# EAGLE design Prototipo_2X (EAGLE 6.5.0)
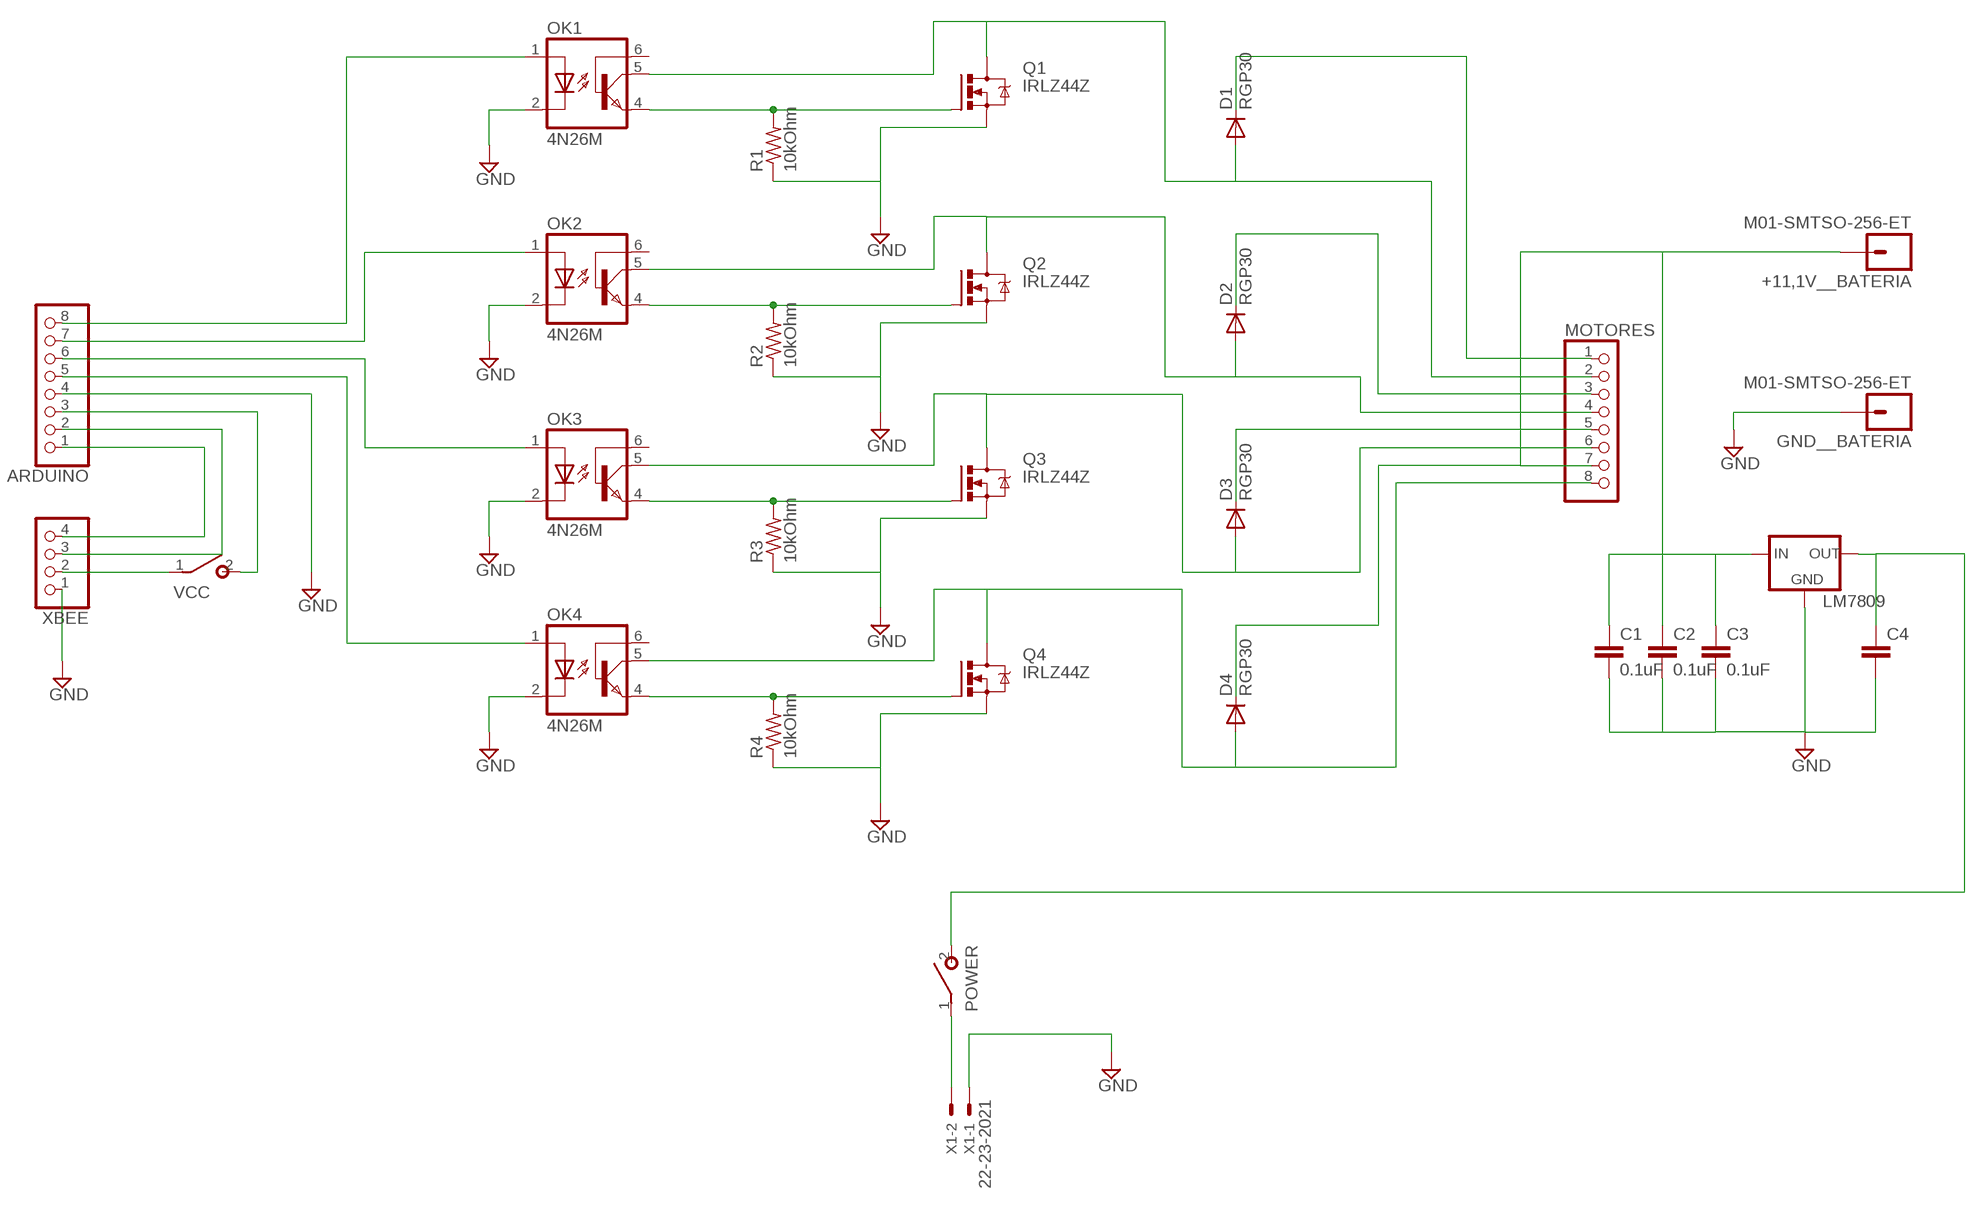
[diagram p0: schematic, sheet 1]

## Parts
+11,1V__BATERIA  M01-SMTSO-256-ET  [SMTSO-256-ET]
ARDUINO  PINHD-1X8/90  [1X08/90]
C1  0.1uF  0.1UF-50V-20%(PTH)KIT-EZ  [CAP-PTH-SMALL-KIT]
C2  0.1uF  0.1UF-50V-20%(PTH)KIT-EZ  [CAP-PTH-SMALL-KIT]
C3  0.1uF  0.1UF-50V-20%(PTH)KIT-EZ  [CAP-PTH-SMALL-KIT]
C4  0.1UF-50V-20%(PTH)KIT-EZ  [CAP-PTH-SMALL-KIT]
D1  RGP30  [DO201-15]
D2  RGP30  [DO201-15]
D3  RGP30  [DO201-15]
D4  RGP30  [DO201-15]
GND__BATERIA  M01-SMTSO-256-ET  [SMTSO-256-ET]
LM7809  78XXL  [78XXL]
MOTORES  PINHD-1X8/90  [1X08/90]
OK1  4N26M  [DIL06]
OK2  4N26M  [DIL06]
OK3  4N26M  [DIL06]
OK4  4N26M  [DIL06]
POWER  SPST  [SPST]
Q1  IRLZ44Z  [TO220BH]
Q2  IRLZ44Z  [TO220BH]
Q3  IRLZ44Z  [TO220BH]
Q4  IRLZ44Z  [TO220BH]
R1  10kOhm  R-US_0207/7  [0207/7]
R2  10kOhm  R-US_0207/7  [0207/7]
R3  10kOhm  R-US_0207/7  [0207/7]
R4  10kOhm  R-US_0207/7  [0207/7]
VCC  SPST  [SPST]
X1  22-23-2021  [22-23-2021]
XBEE  PINHD-1X4  [1X04]

## Nets
GND [power]: ARDUINO.4 C1.2 C2.2 C3.2 C4.2 GND__BATERIA.P$1 LM7809.GND OK1.2(C) OK2.2(C) OK3.2(C) OK4.2(C) Q1.S Q2.S Q3.S Q4.S R1.1 R2.1 R3.1 R4.1 X1.1 XBEE.1
N$1: ARDUINO.8 OK1.1(A)
N$2: ARDUINO.7 OK2.1(A)
N$3: ARDUINO.6 OK3.1(A)
N$4: ARDUINO.5 OK4.1(A)
N$5: ARDUINO.1 XBEE.4
N$6: C4.1 LM7809.OUT POWER.2(S)
N$7: VCC.1(P) XBEE.2
N$8: OK1.4(EMI) Q1.G R1.2
N$9: OK2.4(EMI) Q2.G R2.2
N$10: OK3.4(EMI) Q3.G R3.2
N$11: OK4.4(EMI) Q4.G R4.2
N$12: +11,1V__BATERIA.P$1 C1.1 C2.1 C3.1 D1.C D2.C D3.C D4.C LM7809.IN MOTORES.1 MOTORES.3 MOTORES.5 MOTORES.7
N$13: ARDUINO.2 XBEE.3
N$14: D2.A MOTORES.4 OK2.5(COL) Q2.D
N$15: D3.A MOTORES.6 OK3.5(COL) Q3.D
N$16: D4.A MOTORES.8 OK4.5(COL) Q4.D
N$17: D1.A MOTORES.2 OK1.5(COL) Q1.D
N$18: POWER.1(P) X1.2
N$20: ARDUINO.3 VCC.2(S)
Unconnected: OK1.6(BAS) OK2.6(BAS) OK3.6(BAS) OK4.6(BAS)

## Library data of the parts
+11,1V__BATERIA GND__BATERIA = SparkFun-Connectors:M01: Header 1 Standard 1-pin 0.1" header. Use with straight break away headers (SKU : PRT-00116), right angle break away headers (PRT-00553), swiss pins (PRT-00743), machine pins (PRT-00117), and female headers (PRT-00115).
ARDUINO MOTORES = pinhead:PINHD-1X8: PIN HEADER
C1-C4 = SparkFun-Capacitors:0.1UF-50V-20%(PTH): CAP-08370; PROD_ID: CAP-08370
D1-D4 = diode:RGP30: DIODE fast-recovery rectifier
LM7809 = v-reg:78XXL: VOLTAGE REGULATOR
OK1-OK4 = optocoupler:4N*?M: General Purpose 6-Pin Phototransistor Optocouplers Source: http://www.fairchildsemi.com/ds/4N/4N35-M.pdf; MPN: 4N26-M; OC_FARNELL: 1021350; OC_NEWARK: 98K9089
POWER VCC = gm-switches:SPST
Q1-Q4 = transistor-power:IRLZ44Z: N-Channel HEXFET® Power MOSFET Logic Level AUTOMOTIVE MOSFET Source: http://www.irf.com/product-info/datasheets/data/irlz44zpbf.pdf
R1-R4 = rcl:R-US_: RESISTOR, American symbol
X1 = con-molex:22-23-2021: .100" (2.54mm) Center Header - 2 Pin; MF: MOLEX; MPN: 22-23-2021; OC_FARNELL: 1462926; OC_NEWARK: 25C3832
XBEE = pinhead:PINHD-1X4: PIN HEADER

## Net classes
0 default: clearance 0.205 mm
1 power: width 0.655 mm, drill 10.22 mm, clearance 0.205 mm to class 0, clearance 0.205 mm

## Board
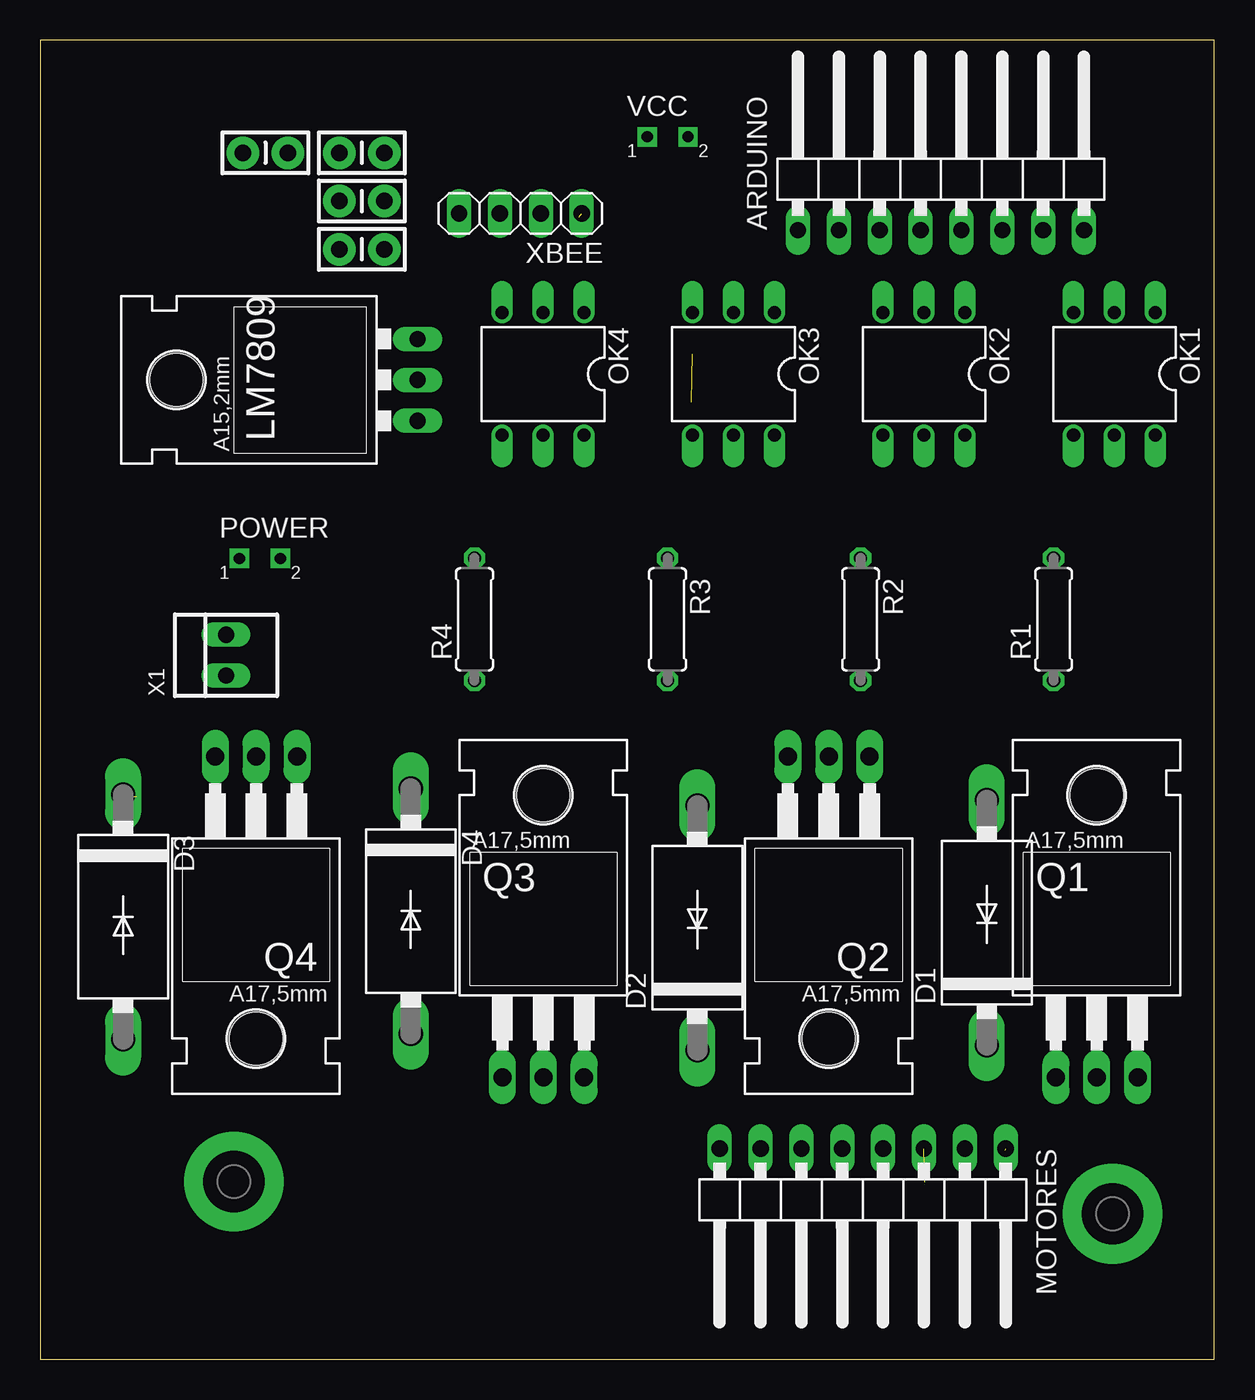
[diagram p1: board, top side]
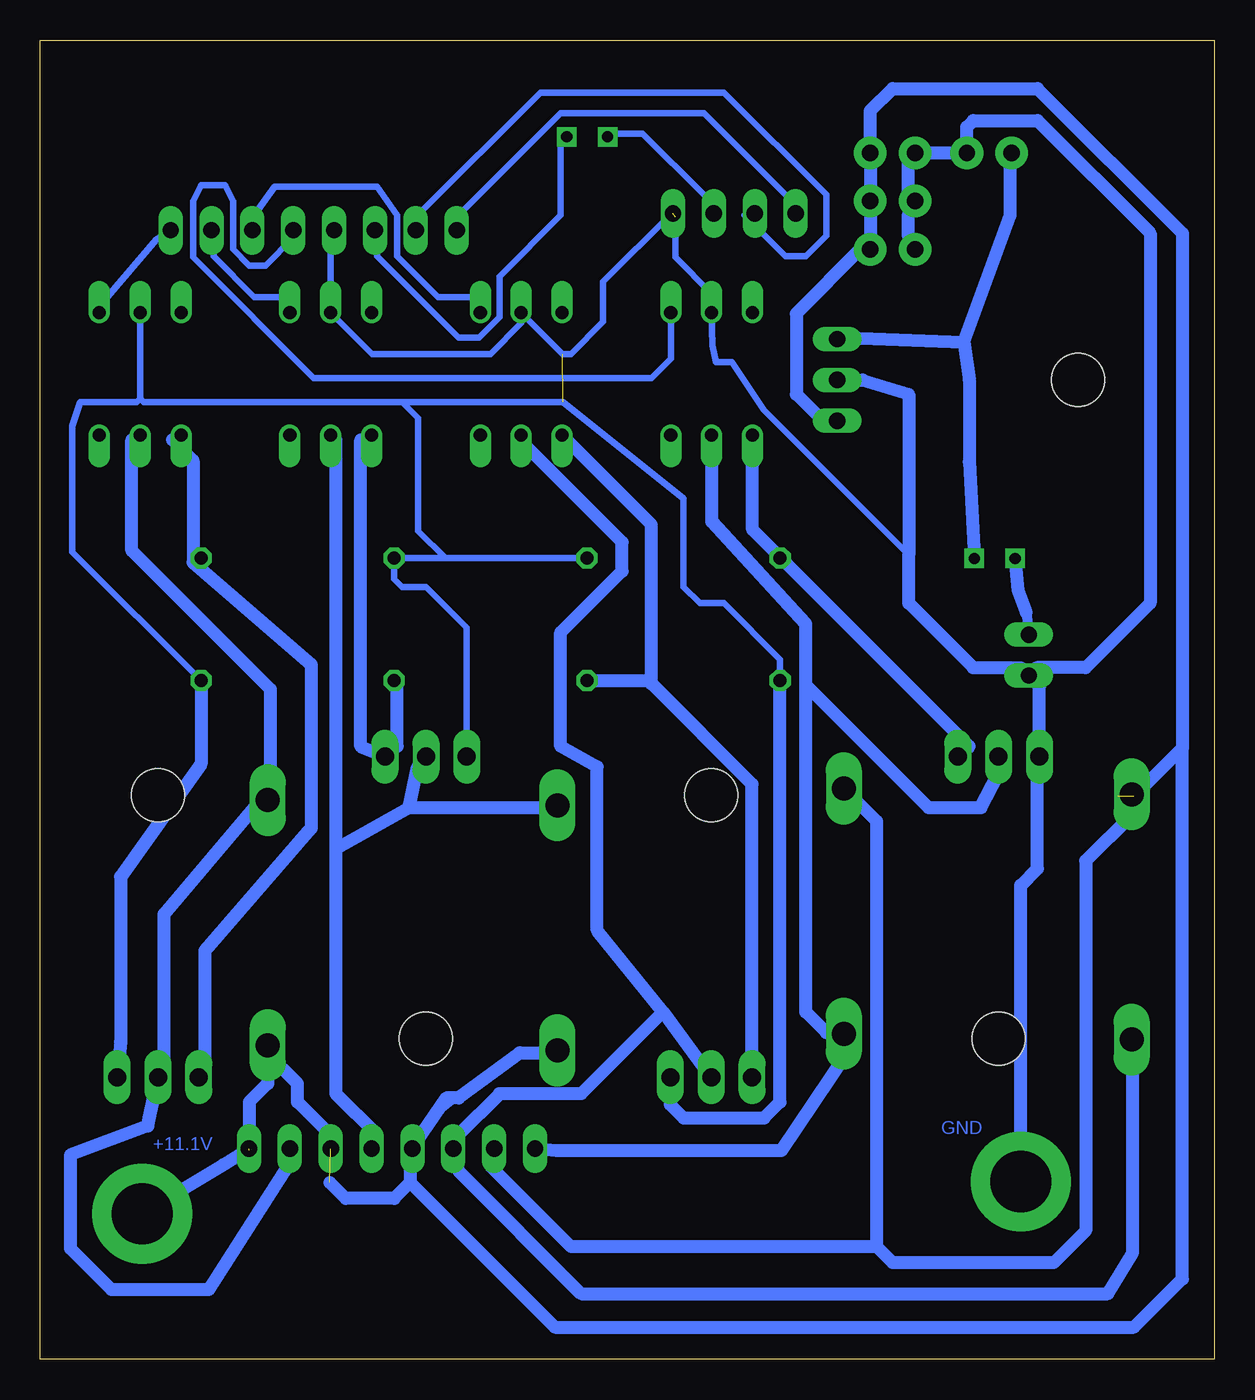
[diagram p2: board, bottom side, seen from below]

Size 73 x 82 mm. Coordinates in mm from the lower left corner, seen from the top.
Outline: 0,0 73,0 73,82 0,82 0,0
Copper layers (1*16): Top 0.035mm / dielectric 1.5mm / Bottom 0.035mm
Design rules: minimum track width 10mil, minimum drill 24mil, track to track 8mil, track to pad 8mil, pad to pad 8mil, via to via 8mil, smd to smd 8mil, copper to edge 40mil, drill to drill 8mil, minimum pad ring 10mil, minimum via ring 8mil, stop-mask expansion 4mil, vias tented up to drill 0mil, thermal gap 10mil

### Footprints (pad centres in the part's own frame; a part is rotated, then mirrored left to right if it is on the bottom)
SMTSO-256-ET = drill 3.81 pad 6.198: P$1 0,0
1X08/90 = drill 1.016 long: 1 -8.89,-3.81; 2 -6.35,-3.81; 3 -3.81,-3.81; 4 -1.27,-3.81; 5 1.27,-3.81; 6 3.81,-3.81; 7 6.35,-3.81; 8 8.89,-3.81
CAP-PTH-SMALL-KIT = drill 1.016 pad 2.032: 1 -1.397,0; 2 1.397,0
DO201-15 = drill 1.499 long: A 7.62,0; C -7.62,0
78XXL = drill 1.016 long: GND 0,-3.81; IN -2.54,-3.81; OUT 2.54,-3.81 | hole 3.302: 0,11.176
DIL06 = drill 0.813 offset: 1 -2.54,-3.81; 2 0,-3.81; 3 2.54,-3.81; 4 2.54,3.81; 5 0,3.81; 6 -2.54,3.81
SPST = drill 0.7 square: 1 -1.27,0; 2 1.27,0
TO220BH = drill 1.118 long: D 0,-6.35; G -2.54,-6.35; S 2.54,-6.35 | hole 3.302: 0,11.176
0207/7 = drill 0.813 octagon: 1 -3.81,0; 2 3.81,0
22-23-2021 = drill 1 long: 1 -1.27,0; 2 1.27,0
1X04 = drill 1.016 long: 1 -3.81,0; 2 -1.27,0; 3 1.27,0; 4 3.81,0

### Placement (x,y rotation side)
+11,1V__BATERIA  66.66,9.04 0 top
ARDUINO  56,74 0 top
C1  20,72 180 top
C2  20,75 180 top
C3  20,69 180 top
C4  14,75 0 top
D1  58.85,27.14 90 top
D2  40.85,26.82 90 top
D3  5.15,27.5 270 top
D4  23.04,27.86 270 top
GND__BATERIA  12.04,11.04 0 top
LM7809  19.65,60.88 90 top
MOTORES  51.13,9.28 180 top
OK1  66.78,61.25 180 top
OK2  54.94,61.25 180 top
OK3  43.1,61.25 180 top
OK4  31.26,61.25 180 top
POWER  13.66,49.78 0 top
Q1  65.68,23.89 0 top
Q2  49.02,31.11 180 top
Q3  31.28,23.89 0 top
Q4  13.42,31.11 180 top
R1  63,46 90 top
R2  51,46 270 top
R3  39,46 270 top
R4  27,46 90 top
VCC  39,76 0 top
X1  11.55,43.77 90 top
XBEE  29.85,71.23 180 top

### Tracks (layer width: path | path; a pad name or v marks a point on that pad's centre or on a via)
GND  (2 unrouted)
  Bottom 0.406: 19,50 28,59 30,62 31,62 31.2,63 OK4.2 31.26,66.26 33.5,68.5 33.5,71 34,71.5 | XBEE.1 33.77,71.23 38,67 38,64.5 40,62.5 40.54,62.5 OK3.2 43.1,64.4 45,62.5 52.38,62.5 OK2.2 54.94,69.98 ARDUINO.4 | OK1.2 66.78,59.72 | 66.78,59.72 67,59.5 70.5,59.5 71,58 71,50.19 R1.1 | 46.5,37.48 46.5,45.5 49,48 50.5,48 51,48.5 R2.1 R3.1 47.81,49.81 49.5,51.5 49.5,58.5 50.5,59.5 | 50.5,59.5 66.56,59.5 66.78,59.72 | R4.1 27,43.5 30.5,47 32,47 33,48 33,53.5 40.5,59.5 50.5,59.5
  Bottom 0.61: 19.05,69.85 C3.2 | 19.05,71.12 C1.2 19.05,72.39 | 19.05,74.93 C2.2
  Bottom 0.813: 19.05,71.12 19.05,69.85 | 19.05,74.93 19.05,72.39 | X1.1 10.88,41.83 Q4.S 11,37.34 11,30.5 12.04,29.46 GND__BATERIA.P$1 | R1.1 63,37 68,30 68,19.76 Q1.S | Q3.S 33.82,15.82 33,15 28,15 27,16 R4.1 | LM7809.GND 21.88,60.88 19,60 19,50 19,47 15,43 12.05,43 X1.1 | 46.5,37.48 Q2.S | C2.2 C4.2 | C4.2 15,75 | C4.2 15.4,76.6 15,77 11,77 4,70 4,47 8,43 11.05,43 X1.1
N$1
  Bottom 0.406: OK1.1 68.85,66.04 65.77,69.62 ARDUINO.8
N$2
  Bottom 0.254: 57.15,66.04 OK2.1
  Bottom 0.406: 57.15,66.04 59.69,66.04 62.23,68.58 62.23,69.85 ARDUINO.7
N$3
  Bottom 0.254: 45.72,66.04 OK3.1
  Bottom 0.406: 45.72,66.04 48.26,66.04 50.8,68.58 50.8,71.12 52.07,72.89 58.42,72.89 59.69,71.12 ARDUINO.6
N$4
  Bottom 0.406: ARDUINO.5 57.27,69.73 59,68 60,68 61,69 61,72 61.5,73 63,73 63.5,72 63.5,68.5 56,61 35,61 33.8,62.2 OK4.1
N$5
  Bottom 0.254: 26.67,72.39 XBEE.4
  Bottom 0.406: 26.67,72.39 31.75,77.47 40.64,77.47 46.99,71.12 ARDUINO.1
N$6
  Bottom 0.254: 12.7,74.93 C4.1
  Bottom 0.61: 22.86,63.5 LM7809.OUT
  Bottom 0.813: 22.86,63.5 15.59,63.23 | 15.59,63.23 15.24,60.88 15.24,55.8 POWER.2 | 12.7,74.93 12.7,71.12 15.59,63.23
N$7
  Bottom 0.254: 38.1,76.2 VCC.1 | 31.75,72.39 XBEE.2
  Bottom 0.406: 38.1,76.2 35.56,76.2 31.75,72.39
N$8
  Bottom 0.254: 63.5,49.53 R1.2
  Bottom 0.813: OK1.4 64.77,57.15 63.5,55.88 63.5,49.53 56.15,43.18 56.15,33.02 62.77,25.4 62.77,18.78 Q1.G
N$9
  Bottom 0.254: 50.8,41.91 R2.2
  Bottom 0.813: 50.8,41.91 50.8,38.1 Q2.G 53.07,38.1 53.07,57.15 OK2.4
N$10
  Bottom 0.813: Q3.G 28.74,35.74 35,42 | 35,42 35,51.88 OK3.4 | R3.2 35.19,42.19 35,42
N$11
  Bottom 0.254: 26.67,49.53 R4.2
  Bottom 0.813: Q4.G 15.24,38.1 26.67,49.53 28.71,51.57 28.71,55.65 OK4.4
N$12  (3 unrouted)
  Bottom 0.254: 46.99,16.24 48.26,15.24 49.53,13.97 MOTORES.5 | 22.86,34.29 D4.C | 5.08,34.29 D3.C
  Bottom 0.813: D2.C 41.91,19.05 43.18,19.05 46.99,16.24 47.76,16.24 50,13 50,11 | D1.C 58.85,19 | 58.85,19 58.85,17.15 60,16 60,13 | MOTORES.1 61.61,12.09 +11,1V__BATERIA.P$1 | MOTORES.3 54.94,13.94 57,16 57,17.15 58.85,19 | LM7809.IN 23.8,58 24,58 26,60 26,65 22,69 C3.1 C1.1 C2.1 21.4,77.6 20,79 11,79 2,70 2,38 | 23,35 23.04,35.04 D4.C 21,33.44 21,7 | 2,38 5,35 5.03,35 D3.C 5.15,33.85 8,31 8,8 10,6 20,6 21,7 | 21,7 40,7 45,12 45,12.87 MOTORES.7 | 50,11 41,2 5,2 2,5 2,38 | 50,11 51,10 54,10 55,11
N$13
  Bottom 0.254: 29.21,71.12 XBEE.3
  Bottom 0.406: 29.21,71.12 26.67,68.58 25.4,68.58 24.13,69.85 24.13,72.39 30.48,78.74 41.91,78.74 49.53,71.12 ARDUINO.2
N$14
  Bottom 0.254: 41.91,34.29 D2.A
  Bottom 0.813: 54.61,31.75 54.61,16.51 52.07,13.97 MOTORES.4 | 54.61,31.75 54.61,57.15 OK2.5 | 54.61,31.75 50.07,34.29 | 50.07,34.29 49.53,36.83 Q2.D | 50.07,34.29 41.91,34.29
N$15
  Bottom 0.254: 46.99,13.97 MOTORES.6
  Bottom 0.813: 34.29,21.59 31.48,17.78 Q3.D | 34.29,21.59 38.37,26.67 38.37,36.83 40.64,38.1 40.64,45.18 36.83,48.99 36.83,50.8 43.18,57.15 OK3.5 | 46.99,13.97 44.45,16.51 39.37,16.51 34.29,21.59 | D3.A 5.08,19.05 5.08,6.62 6.62,4.08 39.37,4.08 46.99,11.7 MOTORES.6
N$16
  Bottom 0.813: 25.4,41.91 25.4,21.59 24.13,20.32 D4.A 22.86,19.05 26.94,12.97 40.91,12.97 MOTORES.8 | 25.4,41.91 25.4,45.72 31.25,52.07 31.25,55.15 OK4.5 | 25.4,41.91 17.78,34.29 14.51,34.29 13.47,36.33 Q4.D
N$17
  Bottom 0.254: 59.69,34.29 D1.A
  Bottom 0.813: MOTORES.2 57.15,12.7 62.5,4.35 68.58,4.35 71.12,6.89 71.12,12.7 66.31,14.51 Q1.D 65.31,18.78 65.31,27.67 59.69,34.29 | OK1.5 67.31,57.15 67.31,50.26 58.69,41.64 58.69,36.56 D1.A
N$18
  Bottom 0.61: 11.7,46.45 X1.2
  Bottom 0.813: 11.7,46.45 12.2,47.8 POWER.1
N$20
  Bottom 0.254: 40.64,76.2 VCC.2
  Bottom 0.406: 40.64,76.2 40.64,71.12 44.45,67.31 44.45,64.77 45.72,63.5 46.99,63.5 52.07,68.58 52.07,69.85 ARDUINO.3

### Text on the board
Bottom: GND | +11.1V